# EAGLE design midi-synch-decoder (EAGLE 5.10)
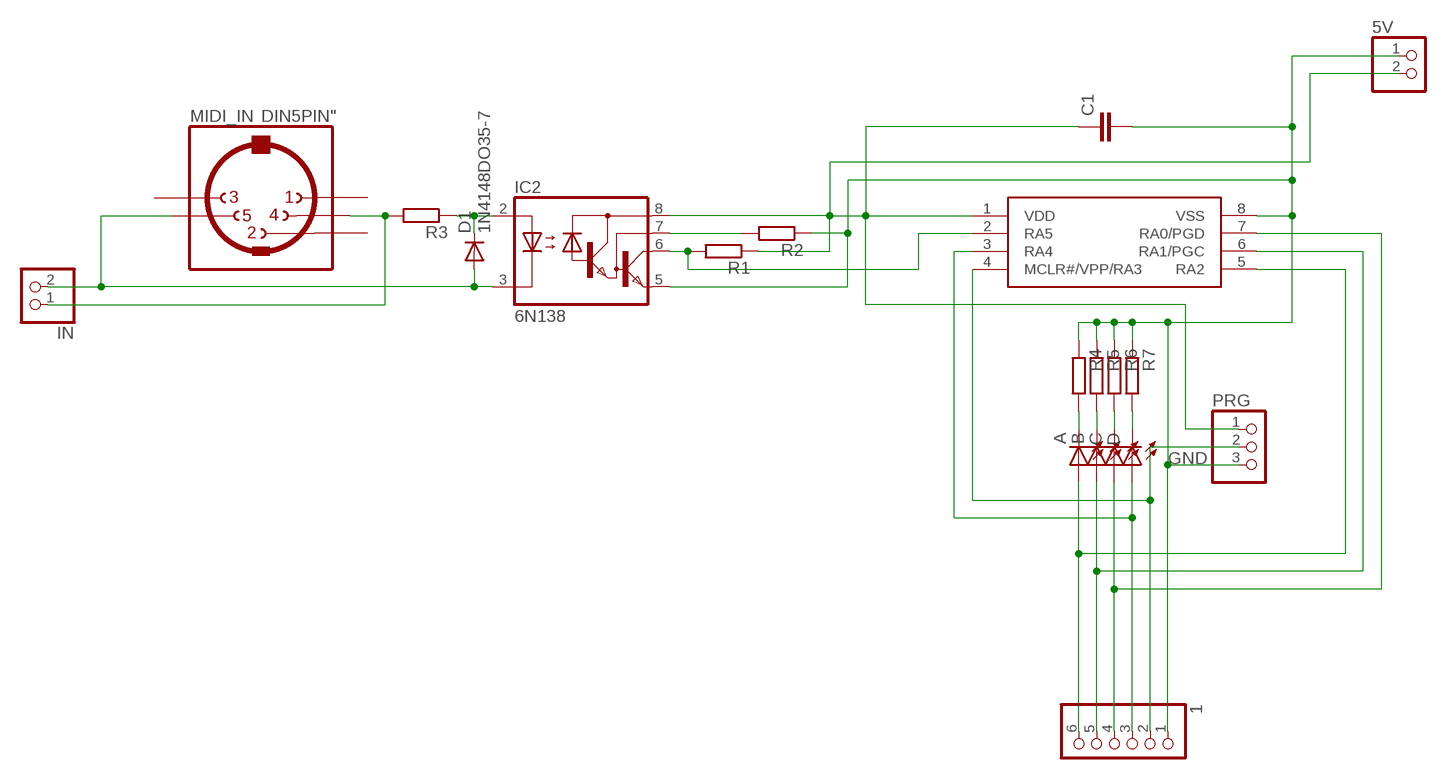
[diagram p0: schematic, sheet 1]

## Parts
1  PINHD-1X6  [1X06]
5V  PINHD-1X2  [1X02]
A  LED3MM  [LED3MM]
B  LED3MM  [LED3MM]
C  LED3MM  [LED3MM]
C1  C-EU025-025X050  [C025-025X050]
D  LED3MM  [LED3MM]
D1  1N4148DO35-7  [DO35-7]
IC1  PIC12F1822  [DIL08]
IC2  6N138  [DIL08]
IN  PINHD-1X2  [1X02]
MIDI_IN  DIN5PIN"  [TRUCONN90]
PRG  PINHD-1X3  [1X03]
R1  R-EU_0207/7  [0207/7]
R2  R-EU_0207/7  [0207/7]
R3  R-EU_0207/7  [0207/7]
R4  R-EU_0207/7  [0207/7]
R5  R-EU_0207/7  [0207/7]
R6  R-EU_0207/7  [0207/7]
R7  R-EU_0207/7  [0207/7]

## Nets
GND: 1.1 5V.1 C1.2 IC1.8(VSS) IC2.5(GND) PRG.3 R2.1 R4.1 R5.1 R6.1 R7.1
N$1: IN.1 MIDI_IN.4 R3.2
N$2: D1.C IC2.2(A) R3.1
N$3: D1.A IC2.3(C) IN.2 MIDI_IN.5
N$4: IC2.7(VB) R2.2
N$5: IC1.2(RA5) IC2.6(VO) R1.2
N$6: 1.4 C.A IC1.7(RA0/PGD)
N$11: 1.6 A.A IC1.5(RA2)
N$12: 1.5 B.A IC1.6(RA1/PGC)
N$14: 1.3 D.A IC1.3(RA4)
N$17: 1.2 IC1.4(MCLR#/VPP/RA3) PRG.2
N$19: A.K(C) R4.2
N$20: B.K(C) R5.2
N$21: C.K(C) R6.2
N$22: D.K(C) R7.2
VCC: 5V.2 C1.1 IC1.1(VDD) IC2.8(VCC) PRG.1 R1.1
Unconnected: MIDI_IN.1 MIDI_IN.2 MIDI_IN.3

## Library data of the parts
1 = pinhead:PINHD-1X6: PIN HEADER
5V IN = pinhead:PINHD-1X2: PIN HEADER
A B C D = adafruit:LED: LED OSRAM: - CHIPLED LG R971, LG N971, LY N971, LG Q971, LY Q971, LO R971, LY R971 LH N974, LH R974 LS Q976, LO Q976, LY Q976 LO Q996 - Hyper CHIPLED LW Q18S LB Q993, LB Q99A, LB R99A - SideLED LS A670, LO A670, LY A670, LG A670, LP A670 LB A673, LV A673, LT A673, LW A673 LH A674 LY A675 LS A676, LA A676, LO A676, LY A676, LW A676 LS A679, LY A679, LG A679 - Hyper Micro SIDELED® LS Y876, LA Y876, LO Y876, LY Y876 LT Y87S - SmartLED LW L88C, LW L88S LB L89C, LB L89S, LG L890 LS L89K, LO L89K, LY L89K LS L896, LA L896, LO L896, LY L896 - TOPLED LS T670, LO T670, LY T670, LG T670, LP T670 LSG T670, LSP T670, LSY T670, LOP T670, LYG T670 LG T671, LOG T671, LSG T671 LB T673, LV T673, LT T673, LW T673 LH T674 LS T676, LA T676, LO T676, LY T676, LB T676, LH T676, LSB T676, LW T676 LB T67C, LV T67C, LT T67C, LS T67K, LO T67K, LY T67K, LW E67C LS E67B, LA E67B, LO E67B, LY E67B, LB E67C, LV E67C, LT E67C LW T67C LS T679, LY T679, LG T679 LS T770, LO T770, LY T770, LG T770, LP T770 LB T773, LV T773, LT T773, LW T773 LH T774 LS E675, LA E675, LY E675, LS T675 LS T776, LA T776, LO T776, LY T776, LB T776 LHGB T686 LT T68C, LB T68C - Hyper Mini TOPLED® LB M676 - Mini TOPLED Santana® LG M470 LS M47K, LO M47K, LY M47K Source: http://www.osram.convergy.de/
C1 = rcl:C-EU: CAPACITOR, European symbol
D1 = diode:1N4148: DIODE high speed (Philips)
IC1 = jasons_stuff:PIC12F1822
IC2 = optocoupler:6N138: MOTOROLA OPTO COUPLER
MIDI_IN = jasons_stuff:DIN5PIN: Female CONNECTOR 5 pins 90 deg. with shield, horizontal (DIN 41524)
PRG = pinhead:PINHD-1X3: PIN HEADER
R1-R7 = resistor:R-EU_: RESISTOR, European symbol

## Board
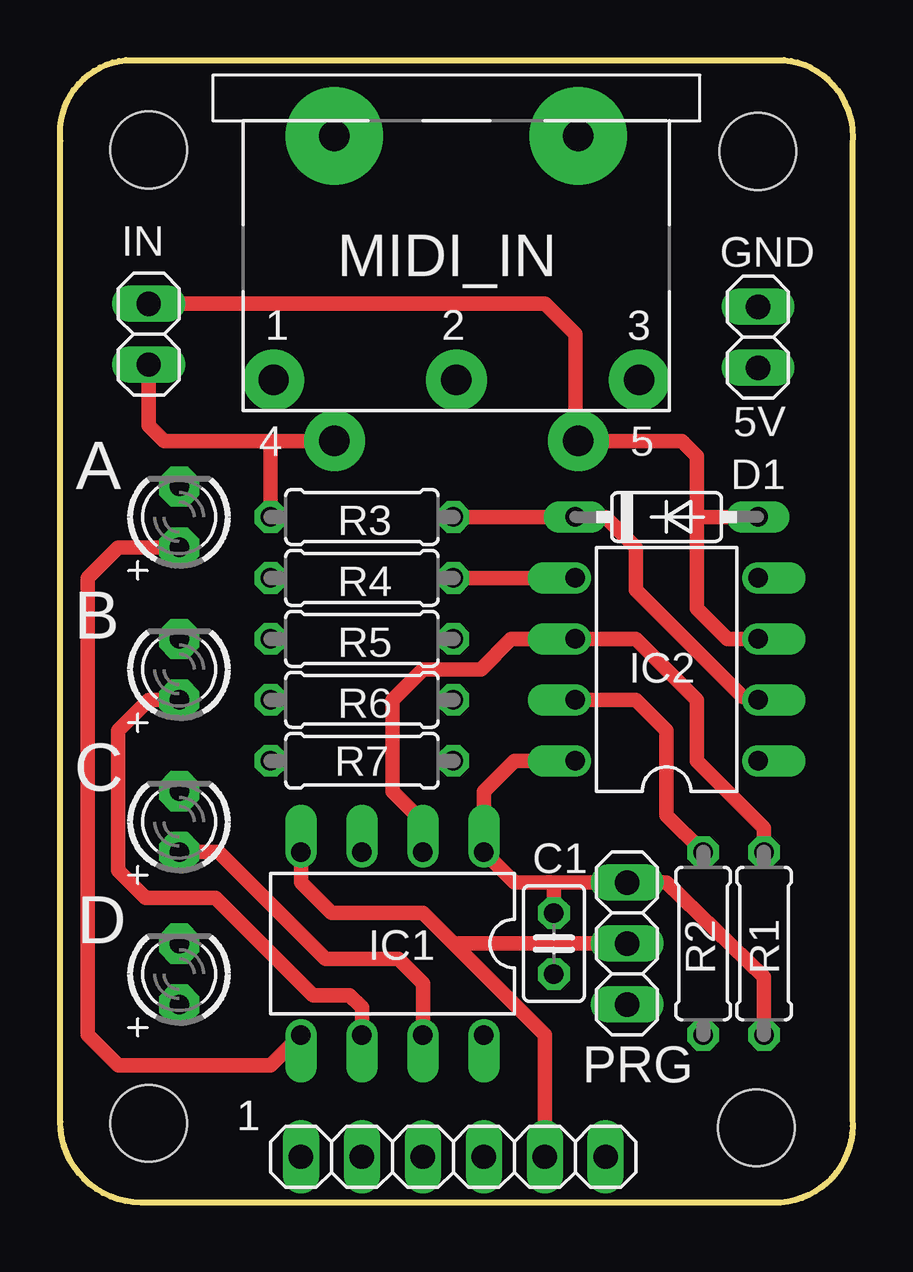
[diagram p1: board, top side]
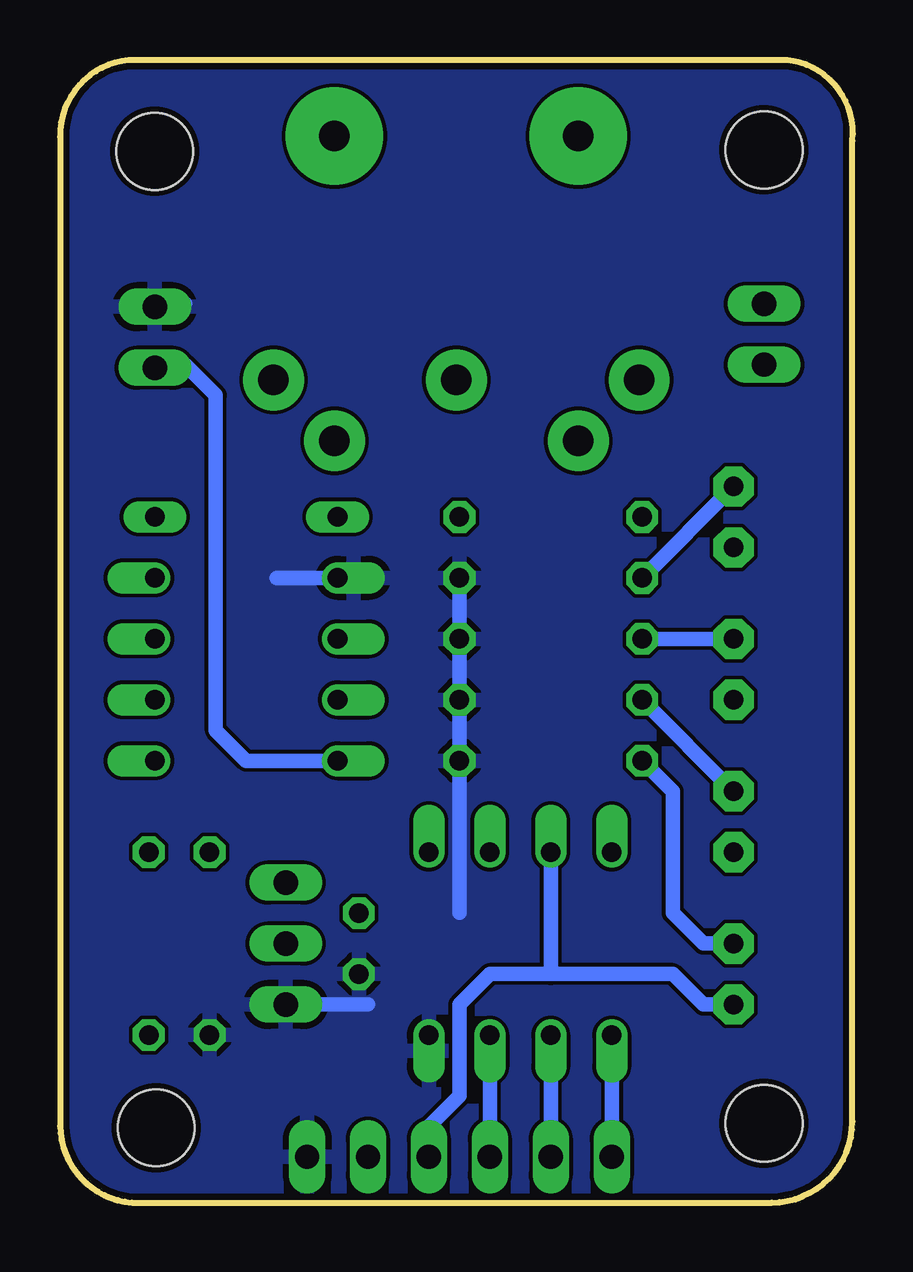
[diagram p2: board, bottom side, seen from below]

Size 33.05 x 47.63 mm. Coordinates in mm from the lower left corner, seen from the top.
Outline: 0.02,44.26 arc-90 2.75,47.63 30.18,47.63 arc-90 33.04,44.13 33.04,3.49 arc-90 30.05,0 3.38,0 arc-90 0.02,3.37 0.02,44.26
Copper layers (1*16): Top 0.035mm / dielectric 1.5mm / Bottom 0.035mm
Design rules "ITEADstudio_DRC": minimum track width 6mil, minimum drill 12mil, track to track 6mil, track to pad 6mil, pad to pad 6mil, via to via 6mil, smd to smd 0mil, copper to edge 10mil, drill to drill 10mil, minimum pad ring 10mil, minimum via ring 6mil, stop-mask expansion 2mil, vias tented up to drill 100mil, thermal gap 10mil
Holes 3.2 mm at 3.7,43.88 29.04,3.11 29.1,43.82 3.7,3.3

### Footprints (pad centres in the part's own frame; a part is rotated, then mirrored left to right if it is on the bottom)
1X06 = drill 1.016 long: 1 -6.35,0; 2 -3.81,0; 3 -1.27,0; 4 1.27,0; 5 3.81,0; 6 6.35,0
1X02 = drill 1.016 long: 1 -1.27,0; 2 1.27,0
LED3MM = drill 0.813 pad 1.676 octagon: A -1.27,0; K 1.27,0
C025-025X050 = drill 0.813 octagon: 1 -1.27,0; 2 1.27,0
DO35-7 = drill 0.813 long: A 3.81,0; C -3.81,0
DIL08 = drill 0.813 offset: 1 -3.81,-3.81; 2 -1.27,-3.81; 3 1.27,-3.81; 4 3.81,-3.81; 5 3.81,3.81; 6 1.27,3.81; 7 -1.27,3.81; 8 -3.81,3.81
TRUCONN90 = drill 1.27 pad 2.54 round: 1 7.62,5.08; 2 0,5.08; 3 -7.62,5.08; 4 5.08,7.62; 5 -5.08,7.62 | drill 1.27 pad 4.064 round: NC -5.08,-5.08; NC@ 5.08,-5.08
1X03 = drill 1.016 long: 1 -2.54,0; 2 0,0; 3 2.54,0
0207/7 = drill 0.813 octagon: 1 -3.81,0; 2 3.81,0

### Placement (x,y rotation side)
1  16.4,1.91 180 top
5V  29.1,36.07 270 top
A  4.97,28.58 90 top
B  4.97,22.23 90 top
C  4.97,15.88 90 top
C1  20.59,10.8 270 top
D  4.97,9.52 90 top
D1  25.29,28.58 0 top
IC1  13.86,10.8 180 top
IC2  25.29,22.23 90 top
IN  3.7,36.2 90 top
MIDI_IN  16.53,39.37 180 top
PRG  23.64,10.8 270 top
R1  29.35,10.8 90 top
R2  26.81,10.8 90 top
R3  12.59,28.58 180 top
R4  12.59,26.04 180 top
R5  12.59,23.5 180 top
R6  12.59,20.96 180 top
R7  12.59,18.41 180 top

### Tracks (layer width: path | path; a pad name or v marks a point on that pad's centre or on a via)
GND
  Top 0.61: R4.1 IC2.5
  Bottom 0.61: R4.1 R5.1 R6.1 R7.1 16.4,12.07 | 20.21,8.26 PRG.3 | IC2.5 24.02,26.04 | 27.83,37.46 28.97,37.46 5V.1
  pour Bottom: -0.11,42.55 arc-90 0.02,42.42 0.02,3.05 arc90 3.19,-0.13 29.86,-0.13 arc90 33.04,3.05 33.04,44.45 arc90 29.86,47.63 2.94,47.63 arc90 0.02,44.7 0.02,42.67 arc-90
N$1
  Top 0.61: 8.78,31.75 4.33,31.75 3.7,32.38 IN.1 | 8.78,31.75 MIDI_IN.4 | 8.78,31.75 R3.2
N$2
  Top 0.61: R3.1 D1.C 22.75,28.58 24.02,27.3 24.02,25.53 28.46,21.08 28.97,21.08 IC2.2
N$3
  Top 0.61: IN.2 20.21,37.46 21.48,36.2 21.48,31.88 MIDI_IN.5 25.92,31.75 26.56,31.12 26.56,28.58 | IC2.3 27.83,23.5 26.56,24.77 26.56,28.58 | 26.56,28.58 D1.A
N$4
  Top 0.61: IC2.7 24.02,20.96 25.29,19.69 25.29,16.13 R2.2
N$5
  Top 0.61: R1.2 29.35,15.62 26.56,18.41 26.56,20.96 24.02,23.5 IC2.6 18.81,23.5 17.54,22.23 15.13,22.23 13.86,20.96 13.86,17.15 15.13,15.88 IC1.2
N$6
  Top 0.61: C.A 6.62,14.61 11.07,10.16 14.11,10.16 15.13,9.14 IC1.7
  Bottom 0.61: 1.4 IC1.7
N$11
  Top 0.61: A.A 2.43,27.3 1.16,26.04 1.16,6.98 2.43,5.72 8.78,5.72 IC1.5
  Bottom 0.61: IC1.5 1.6
N$12
  Top 0.61: B.A 3.7,20.96 2.43,19.69 2.43,13.84 3.57,12.7 6.49,12.7 10.56,8.64 12.08,8.64 12.59,8.13 IC1.6
  Bottom 0.61: 1.5 IC1.6
N$14
  Bottom 0.61: 1.3 17.67,3.18 16.4,4.45 16.4,8.26 15.13,9.52 12.59,9.52 | D.A 6.24,8.26 7.51,9.52 12.59,9.52 | 12.59,9.52 IC1.3
N$17
  Top 0.61: IC1.4 10.05,13.34 11.32,12.07 15.13,12.07 16.4,10.8 | 1.2 20.21,6.98 16.4,10.8 | 16.4,10.8 PRG.2
N$19
  Bottom 0.61: A.K R4.2
N$20
  Bottom 0.61: B.K R5.2
N$21
  Bottom 0.61: C.K R6.2
N$22
  Bottom 0.61: R7.2 7.51,17.15 7.51,12.07 6.24,10.8 D.K
VCC
  Top 0.61: 20.59,13.34 18.94,13.34 IC1.1 17.67,17.15 18.94,18.41 IC2.8 | R1.1 29.35,9.4 25.29,13.34 PRG.1 20.59,13.34 | C1.1 20.59,13.34
  Bottom 0.61: 27.96,34.8 5V.2 28.97,34.93 27.83,34.93 26.56,33.66 26.56,19.69 25.29,18.41 IC2.8 20.21,18.41

### Text on the board
tPlace: GND
tValues: 5 | 4
bValues: MIDI-Synch | MIDI-Synch | rev 1 | hotchk155